# EAGLE schematic test_parts (EAGLE 6.3)
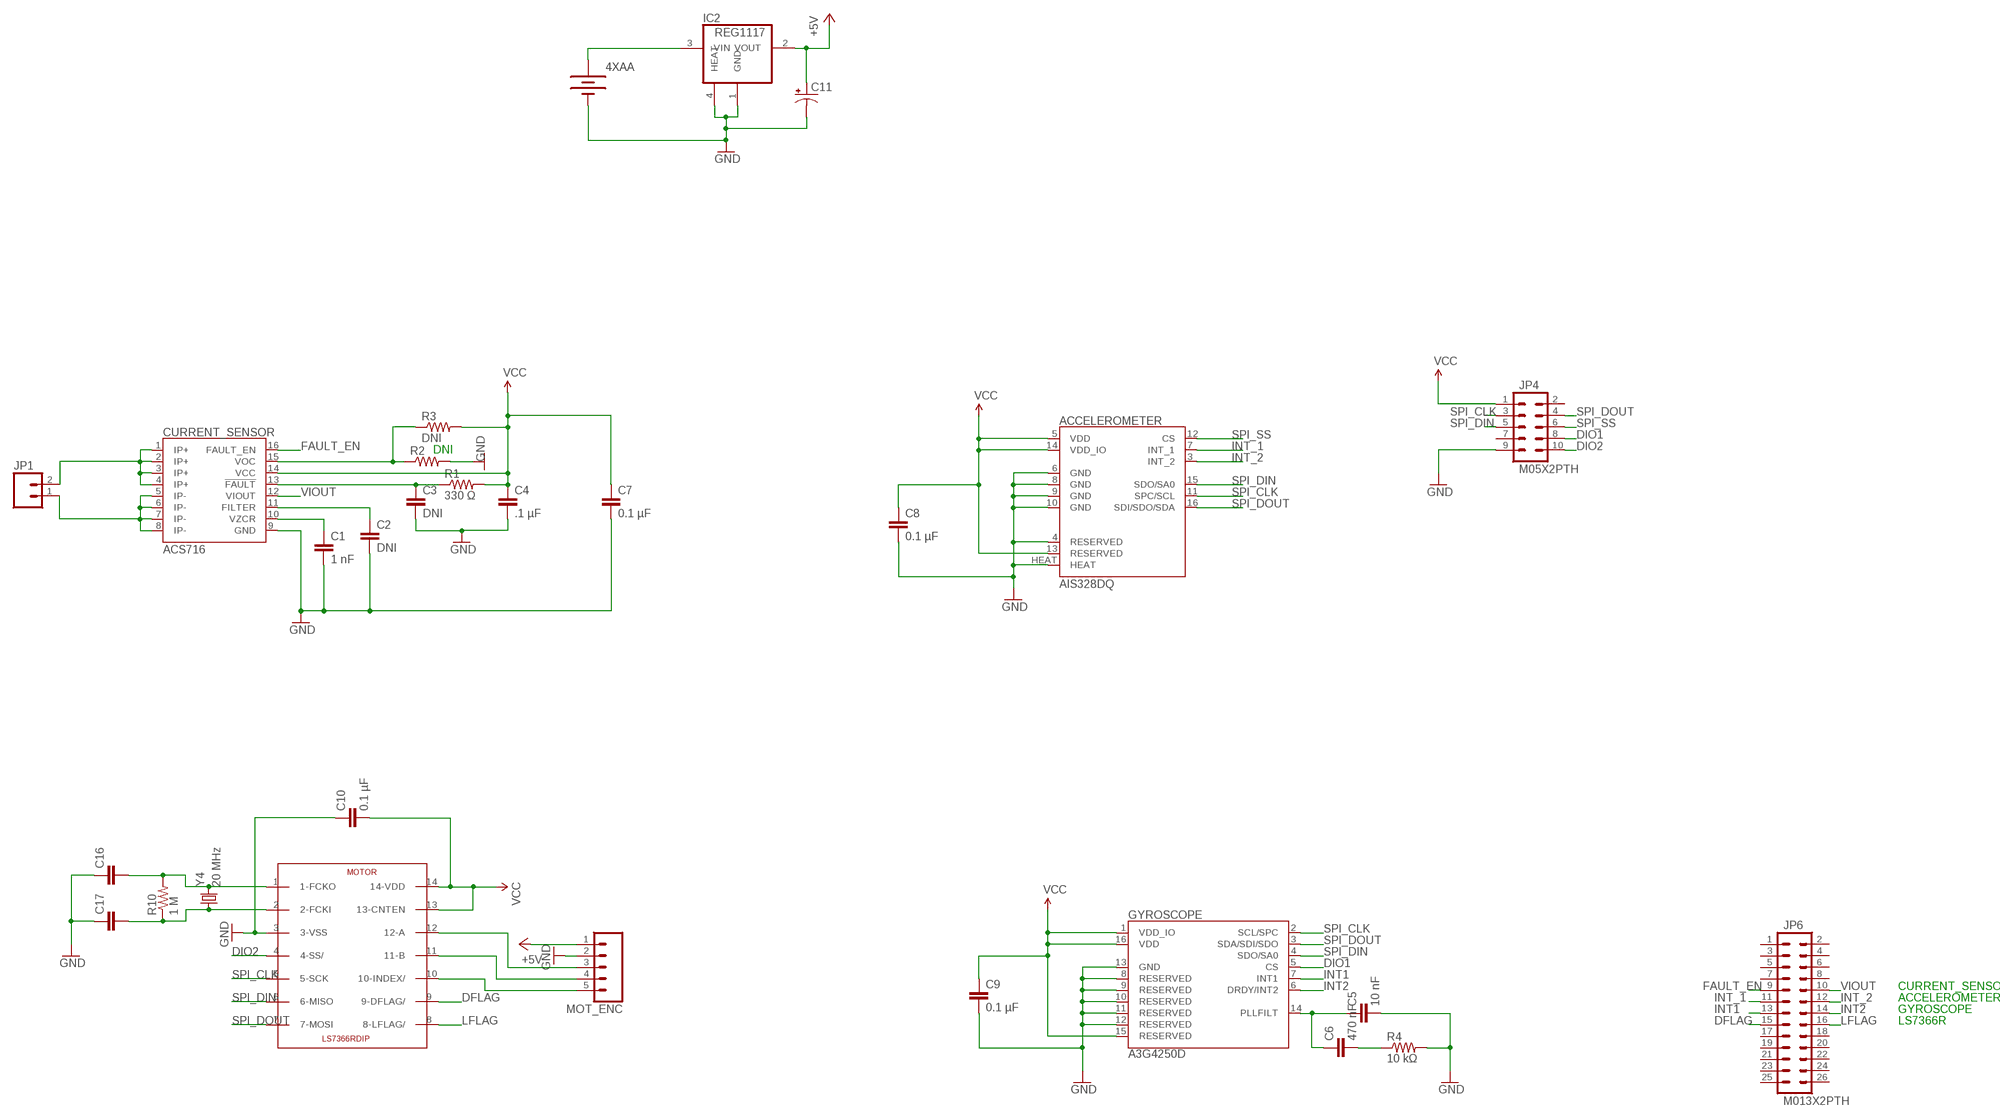
[diagram p0: schematic, sheet 1]

## Parts
4XAA  BATTERYTOP  [BH4AA-PC]
ACCELEROMETER  AIS328DQ  AIS328DQQFPN-24  [QFPN-24]
C1  1 nF  CAP0603-CAP  [0603-CAP]
C2  DNI  CAP0603-CAP  [0603-CAP]
C3  DNI  CAP0603-CAP  [0603-CAP]
C4  .1 µF  CAP0603-CAP  [0603-CAP]
C5  10 nF  CAP0603-CAP  [0603-CAP]
C6  470 nF  CAP0603-CAP  [0603-CAP]
C7  0.1 µF  CAP0603-CAP  [0603-CAP]
C8  0.1 µF  CAP0603-CAP  [0603-CAP]
C9  0.1 µF  CAP0603-CAP  [0603-CAP]
C10  0.1 µF  CAP0603-CAP  [0603-CAP]
C11  CAP_POL0603  [0603-CAP]
C16  CAP0603-CAP  [0603-CAP]
C17  CAP0603-CAP  [0603-CAP]
CURRENT_SENSOR  ACS716  [SOICW]
GYROSCOPE  A3G4250D  A3G4250DLGA16  [LGA-16]
IC2  REG1117  [SOT223]
JP1  M02PTH  [1X02]
JP4  M05X2PTH  [AVR_ICSP]
JP6  M013X2PTH  [AVR_ICSP]
MOT_ENC  M05PTH  [1X05]
MOTOR  LS7366RDIP  [DIL14]
R1  330 Ω  RESISTOR0603-RES  [0603-RES]
R2  DNI  RESISTOR0603-RES  [0603-RES]
R3  DNI  RESISTOR0603-RES  [0603-RES]
R4  10 kΩ  RESISTOR0603-RES  [0603-RES]
R10  1 M  R-US_R0603  [R0603]
Y4  20 MHz  CRYSTALHC49US  [HC49US]

## Nets
+5V: C11.1(+) IC2.2(VOUT) MOT_ENC.1
DFLAG: JP6.15 MOTOR.9(9-DFLAG/)
DIO1: GYROSCOPE.5(CS) JP4.8
DIO2: JP4.10 MOTOR.4(4-SS/)
FAULT_EN: CURRENT_SENSOR.16(FAULT_EN) JP6.9
GND: 4XAA.- ACCELEROMETER.4(RESERVED) ACCELEROMETER.6(GND) ACCELEROMETER.8(GND) ACCELEROMETER.9(GND) ACCELEROMETER.10(GND) ACCELEROMETER.HEAT C1.2 C2.2 C3.2 C4.2 C5.2 C7.2 C8.2 C9.2 C10.1 C11.2(-) C16.1 C17.1 CURRENT_SENSOR.9(GND) GYROSCOPE.8(RESERVED) GYROSCOPE.9(RESERVED) GYROSCOPE.10(RESERVED) GYROSCOPE.11(RESERVED) GYROSCOPE.12(RESERVED) GYROSCOPE.13(GND) IC2.1(GND) IC2.4(HEAT) JP4.9 MOT_ENC.2 MOTOR.3(3-VSS) R2.2 R4.2
INT1: GYROSCOPE.7(INT1) JP6.13
INT2: GYROSCOPE.6(DRDY/INT2) JP6.14
INT_1: ACCELEROMETER.7(INT_1) JP6.11
INT_2: ACCELEROMETER.3(INT_2) JP6.12
LFLAG: JP6.16 MOTOR.8(8-LFLAG/)
N$1: CURRENT_SENSOR.1(IP+) CURRENT_SENSOR.2(IP+) CURRENT_SENSOR.3(IP+) CURRENT_SENSOR.4(IP+) JP1.2
N$2: CURRENT_SENSOR.5(IP-) CURRENT_SENSOR.6(IP-) CURRENT_SENSOR.7(IP-) CURRENT_SENSOR.8(IP-) JP1.1
N$3: C3.1 CURRENT_SENSOR.13(!FAULT) R1.1
N$4: C1.1 CURRENT_SENSOR.10(VZCR)
N$5: C2.1 CURRENT_SENSOR.11(FILTER)
N$6: 4XAA.+ IC2.3(VIN)
N$7: CURRENT_SENSOR.15(VOC) R2.1 R3.1
N$14: C5.1 C6.1 GYROSCOPE.14(PLLFILT)
N$15: C6.2 R4.1
N$18: C16.2 MOTOR.1(1-FCKO) R10.2 Y4.2
N$19: C17.2 MOTOR.2(2-FCKI) R10.1 Y4.1
N$20: MOT_ENC.3 MOTOR.12(12-A)
N$21: MOT_ENC.4 MOTOR.11(11-B)
N$22: MOT_ENC.5 MOTOR.10(10-INDEX/)
SPI_CLK: ACCELEROMETER.11(SPC/SCL) GYROSCOPE.2(SCL/SPC) JP4.3 MOTOR.5(5-SCK)
SPI_DIN: ACCELEROMETER.15(SDO/SA0) GYROSCOPE.4(SDO/SA0) JP4.5 MOTOR.6(6-MISO)
SPI_DOUT: ACCELEROMETER.16(SDI/SDO/SDA) GYROSCOPE.3(SDA/SDI/SDO) JP4.4 MOTOR.7(7-MOSI)
SPI_SS: ACCELEROMETER.12(CS) JP4.6
VCC: ACCELEROMETER.5(VDD) ACCELEROMETER.13(RESERVED) ACCELEROMETER.14(VDD_IO) C4.1 C7.1 C8.1 C9.1 C10.2 CURRENT_SENSOR.14(VCC) GYROSCOPE.1(VDD_IO) GYROSCOPE.15(RESERVED) GYROSCOPE.16(VDD) JP4.1 MOTOR.13(13-CNTEN) MOTOR.14(14-VDD) R1.2 R3.2
VIOUT: CURRENT_SENSOR.12(VIOUT) JP6.10
Unconnected: JP4.2 JP4.7 JP6.1 JP6.2 JP6.3 JP6.4 JP6.5 JP6.6 JP6.7 JP6.8 JP6.17 JP6.18 JP6.19 JP6.20 JP6.21 JP6.22 JP6.23 JP6.24 JP6.25 JP6.26

## Notes on the sheet
- CURRENT_SENSOR
- ACCELEROMETER
- GYROSCOPE
- LS7366R

## Library data of the parts
4XAA = lyndon:BATTERY: Battery Holders Various common sizes : AA, AAA, 20mm coin cell and 12mm coin cell.
ACCELEROMETER = lyndon:AIS328DQ
C1-C10 = SparkFun:CAP: Capacitor Standard 0603 ceramic capacitor, and 0.1" leaded capacitor.
C11 = nick_nu32_pic32mx795_v1:CAP_POL: Capacitor Polarized These are standard SMD and PTH capacitors. Normally 10uF, 47uF, and 100uF in electrolytic and tantalum varieties. Always verify the external diameter of the through hole cap, it varies with capacity, voltage, and manufacturer. The EIA devices should be standard.
C16 C17 = nick_nu32_pic32mx795_v1:CAP: Capacitor Standard 0603 ceramic capacitor, and 0.1" leaded capacitor.
CURRENT_SENSOR = lyndon:ACS716
GYROSCOPE = lyndon:A3G4250D
IC2 = nick_nu32_pic32mx795_v1:REG1117: 800mA and 1A Low Dropout (LDO) Positive Regulator 1.8V, 2.5V, 2.85V, 3.3V, 5V, and Adj
JP1 = SparkFun:M02: Header 2 Standard 2-pin 0.1" header. Use with straight break away headers (SKU : PRT-00116), right angle break away headers (PRT-00553), swiss pins (PRT-00743), machine pins (PRT-00117), and female headers (PRT-00115). Molex polarized connector foot print use with SKU : PRT-08233 with associated crimp pins and housings.
JP4 = SparkFun:M05X2: Header 5x2 Standard 10-pin dual row 0.1" header. Commonly used with AVR-ISP. Use with Spark Fun Electronics SKU: PRT-00778
JP6 = lyndon:M013X2: Header 5x2 Standard 10-pin dual row 0.1" header. Commonly used with AVR-ISP. Use with Spark Fun Electronics SKU: PRT-00778
MOT_ENC = andy-monkeybot:M05: Header 5 Standard 5-pin 0.1" header. Use with straight break away headers (SKU : PRT-00116), right angle break away headers (PRT-00553), swiss pins (PRT-00743), machine pins (PRT-00117), and female headers (PRT-00115). Molex polarized connector foot print use with SKU : PRT-08230 with associated crimp pins and housings.
MOTOR = lyndon:LS7366R
R1-R4 = SparkFun:RESISTOR: Resistor Basic schematic elements and footprints for 0603, 1206, and PTH resistors.
R10 = monkeybot:R-US_: RESISTOR, American symbol
Y4 = andy-monkeybot:CRYSTAL: Crystals Various standard crystals. Proven footprints. Spark Fun Electronics SKU : COM-00534